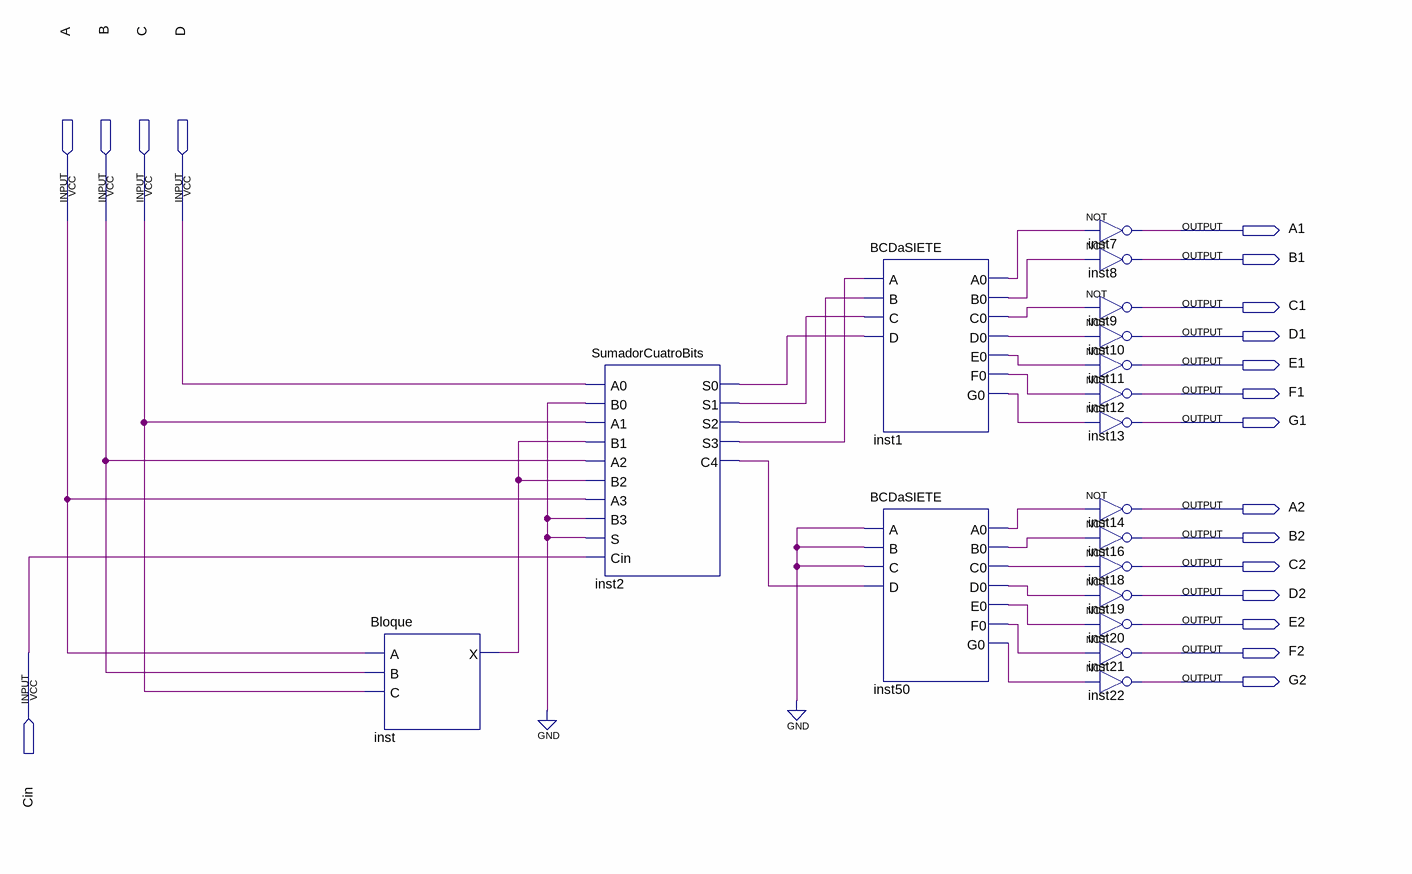
[diagram p0: schematic sheet]
// Quartus schematic ConversorBinario.bdf as structural Verilog: 18 symbols, 19 pins
module ConversorBinario (
  input  A,
  input  B,
  input  C,
  input  D,
  input  Cin,
  output A1,
  output B1,
  output C1,
  output D1,
  output E1,
  output F1,
  output G1,
  output A2,
  output B2,
  output C2,
  output D2,
  output E2,
  output F2,
  output G2
);

  wire inst1_a0, inst1_b0, inst1_c0, inst1_d0, inst1_e0, inst1_f0, inst1_g0, inst2_c4, inst2_s0, inst2_s1,
       inst2_s2, inst2_s3, inst50_a0, inst50_b0, inst50_c0, inst50_d0, inst50_e0, inst50_f0, inst50_g0,
       inst_x;

  Bloque inst (.A(A), .B(B), .C(C), .X(inst_x));
  SumadorCuatroBits inst2 (
    .A0(D), .B0(1'b0), .A1(C), .B1(inst_x), .A2(B), .B2(inst_x), .A3(A), .B3(1'b0), .S(1'b0), .Cin(Cin),
    .S0(inst2_s0), .S1(inst2_s1), .S2(inst2_s2), .S3(inst2_s3), .C4(inst2_c4));
  BCDaSIETE inst1 (
    .A(inst2_s3), .B(inst2_s2), .C(inst2_s1), .D(inst2_s0), .A0(inst1_a0), .B0(inst1_b0), .C0(inst1_c0),
    .D0(inst1_d0), .E0(inst1_e0), .F0(inst1_f0), .G0(inst1_g0));
  BCDaSIETE inst50 (
    .A(1'b0), .B(1'b0), .C(1'b0), .D(inst2_c4), .A0(inst50_a0), .B0(inst50_b0), .C0(inst50_c0),
    .D0(inst50_d0), .E0(inst50_e0), .F0(inst50_f0), .G0(inst50_g0));
  not inst7 (A1, inst1_a0);
  not inst8 (B1, inst1_b0);
  not inst9 (C1, inst1_c0);
  not inst10 (D1, inst1_d0);
  not inst11 (E1, inst1_e0);
  not inst12 (F1, inst1_f0);
  not inst13 (G1, inst1_g0);
  not inst14 (A2, inst50_a0);
  not inst16 (B2, inst50_b0);
  not inst18 (C2, inst50_c0);
  not inst19 (D2, inst50_d0);
  not inst20 (E2, inst50_e0);
  not inst21 (F2, inst50_f0);
  not inst22 (G2, inst50_g0);
endmodule
